# Altium project Driver.PrjPcb
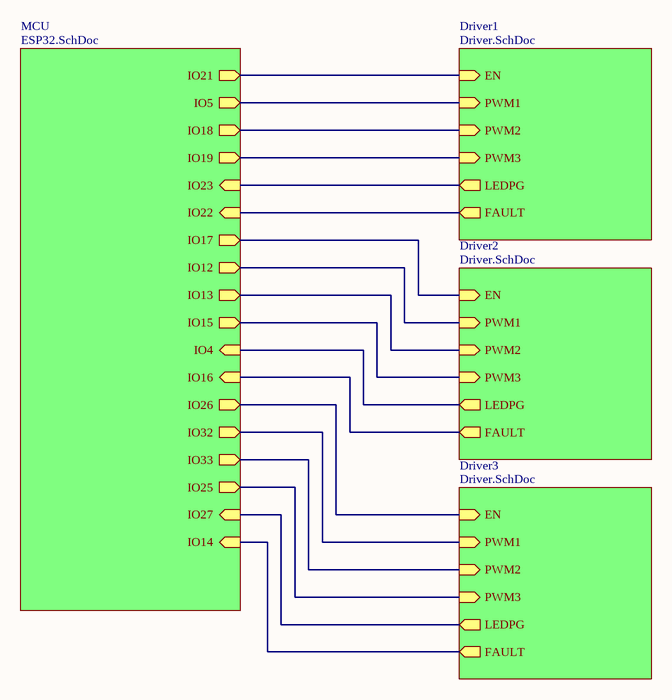
[diagram p0: Top_Design.SchDoc]
3 sheets, 38 parts. Net scope: hierarchical (ports join the sheet entries above them; power ports are global).
Board file: PCB1.PcbDoc
Sheets:
  Top_Design.SchDoc
    Driver1 = Driver.SchDoc
    MCU = ESP32.SchDoc
    Driver2 = Driver.SchDoc
    Driver3 = Driver.SchDoc

## Sheet Top_Design.SchDoc
size A4; SheetNumber: 1; SheetTotal: 3

### Sub-sheets
Driver1 = Driver.SchDoc: EN (in), PWM1 (in), PWM2 (in), PWM3 (in), LEDPG (out), FAULT (out)
Driver2 = Driver.SchDoc: EN (in), PWM1 (in), PWM2 (in), PWM3 (in), LEDPG (out), FAULT (out)
Driver3 = Driver.SchDoc: EN (in), PWM1 (in), PWM2 (in), PWM3 (in), LEDPG (out), FAULT (out)
MCU = ESP32.SchDoc: IO21 (out), IO5 (out), IO18 (out), IO19 (out), IO23 (in), IO22 (in), IO17 (out), IO12 (out), IO13 (out), IO15 (out), IO4 (in), IO16 (in), IO26 (out), IO32 (out), IO33 (out), IO25 (out), IO27 (in), IO14 (in)

### Nets
NetIC1_1_1: sheet Driver1/EN, sheet MCU/IO21
NetIC1_1_3: sheet Driver1/PWM3, sheet MCU/IO19
NetIC1_1_4: sheet Driver1/PWM2, sheet MCU/IO18
NetIC1_1_5: sheet Driver1/PWM1, sheet MCU/IO5
NetIC1_1_11: sheet Driver1/LEDPG, sheet MCU/IO23
NetIC1_1_12: sheet Driver1/FAULT, sheet MCU/IO22
NetIC1_2_1: sheet MCU/IO17, sheet Driver2/EN
NetIC1_2_3: sheet MCU/IO15, sheet Driver2/PWM3
NetIC1_2_4: sheet MCU/IO13, sheet Driver2/PWM2
NetIC1_2_5: sheet MCU/IO12, sheet Driver2/PWM1
NetIC1_2_11: sheet MCU/IO4, sheet Driver2/LEDPG
NetIC1_2_12: sheet MCU/IO16, sheet Driver2/FAULT
NetIC1_3_1: sheet MCU/IO26, sheet Driver3/EN
NetIC1_3_3: sheet MCU/IO25, sheet Driver3/PWM3
NetIC1_3_4: sheet MCU/IO33, sheet Driver3/PWM2
NetIC1_3_5: sheet MCU/IO32, sheet Driver3/PWM1
NetIC1_3_11: sheet MCU/IO27, sheet Driver3/LEDPG
NetIC1_3_12: sheet MCU/IO14, sheet Driver3/FAULT

## Sheet Driver.SchDoc
size A4; SheetNumber: 3; SheetTotal: 3
Used 3 times, as channels Driver1, Driver2, Driver3. Parts and nets are listed once, with the designators drawn on the sheet.
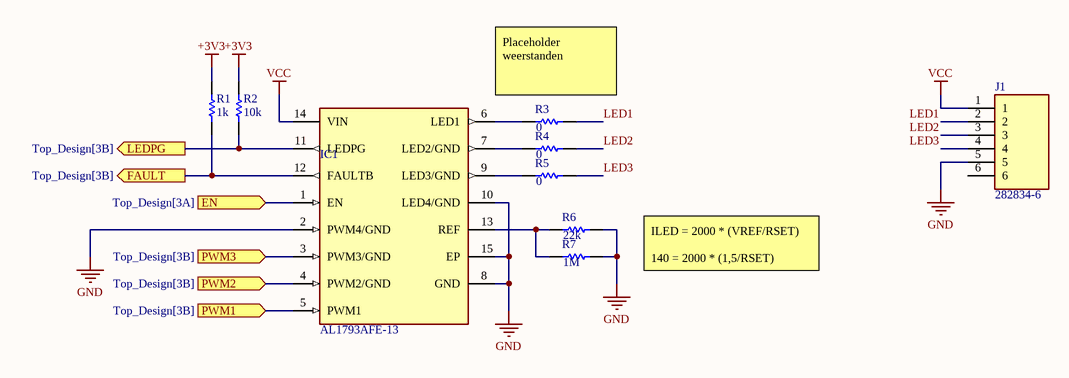
[diagram p1: Driver.SchDoc]

### Parts
IC1  AL1793AFE-13  [AL1793AFE13]
J1  282834-6  [2828346]
R1  value 1k  [RESC2013X70X40ML20T20]  (hidden comment: Resistor 1k +/-1% 0805 125 mW)
R2  value 10k  [RESC2013X70X40ML20T20]  (hidden comment: Resistor 1k +/-1% 0805 125 mW)
R3  value 0  [RESC2013X70X40ML20T20]  (hidden comment: Resistor 1k +/-1% 0805 125 mW)
R4  value 0  [RESC2013X70X40ML20T20]  (hidden comment: Resistor 1k +/-1% 0805 125 mW)
R5  value 0  [RESC2013X70X40ML20T20]  (hidden comment: Resistor 1k +/-1% 0805 125 mW)
R6  value 22k  [RESC2013X70X40ML20T20]  (hidden comment: Resistor 1k +/-1% 0805 125 mW)
R7  value 1M  [RESC2013X70X40ML20T20]  (hidden comment: Resistor 1k +/-1% 0805 125 mW)

### Ports
EN (in, see Top_Design[3A]), FAULT (out, see Top_Design[3B]), LEDPG (out, see Top_Design[3B]), PWM1 (in, see Top_Design[3B]), PWM2 (in, see Top_Design[3B]), PWM3 (in, see Top_Design[3B])

### Nets
+3V3: R1.2 R2.2
GND: IC1.2(PWM4/GND) IC1.8(GND) IC1.10(LED4/GND) IC1.15(EP) J1.5 R6.2 R7.2
VCC: IC1.14(VIN) J1.1
EN: IC1.1(EN) ; port EN
FAULT: IC1.12(FAULTB) R1.1 ; port FAULT
LED1: J1.2 R3.2
LED2: J1.3 R4.2
LED3: J1.4 R5.2
LEDPG: IC1.11(LEDPG) R2.1 ; port LEDPG
PWM1: IC1.5(PWM1) ; port PWM1
PWM2: IC1.4(PWM2/GND) ; port PWM2
PWM3: IC1.3(PWM3/GND) ; port PWM3
NetIC1_6: IC1.6(LED1) R3.1
NetIC1_7: IC1.7(LED2/GND) R4.1
NetIC1_9: IC1.9(LED3/GND) R5.1
NetIC1_13: IC1.13(REF) R6.1 R7.1

Not connected (* = marked no-connect by the designer): J1 6

### Channels
Driver1: designators end in _1; ports EN=NetIC1_1_1 FAULT=NetIC1_1_12 LEDPG=NetIC1_1_11 PWM1=NetIC1_1_5 PWM2=NetIC1_1_4 PWM3=NetIC1_1_3
Driver2: designators end in _2; ports EN=NetIC1_2_1 FAULT=NetIC1_2_12 LEDPG=NetIC1_2_11 PWM1=NetIC1_2_5 PWM2=NetIC1_2_4 PWM3=NetIC1_2_3
Driver3: designators end in _3; ports EN=NetIC1_3_1 FAULT=NetIC1_3_12 LEDPG=NetIC1_3_11 PWM1=NetIC1_3_5 PWM2=NetIC1_3_4 PWM3=NetIC1_3_3

### Notes on the sheet
- Placeholder weerstanden
- ILED = 2000 * (VREF/RSET)
  140 = 2000 * (1,5/RSET)

### Library data of the parts
IC1 = AL1793AFE-13: Integrated Circuit; Manufacturer_Name: Diodes Incorporated; Datasheet Link: https://www.diodes.com//assets/Datasheets/AL1791_1792_1793_1794.pdf; Height: 0.65mm; Manufacturer_Part_Number: AL1793AFE-13; Mouser Part Number: 621-AL1793AFE-13; Mouser Price/Stock: https://www.mouser.co.uk/ProductDetail/Diodes-Incorporated/AL1793AFE-13?qs=bKenfurwlskeSg5Tj2A9LQ%3D%3D; Arrow Part Number: AL1793AFE-13; Arrow Price/Stock: https://www.arrow.com/en/products/al1793afe-13/diodes-incorporated?region=nac
J1 = 282834-6: Connector; Manufacturer_Name: TE Connectivity; Datasheet Link: https://www.te.com/commerce/DocumentDelivery/DDEController?Action=srchrtrv&DocNm=1-1773458-1_EURO_STYLE_QRG&DocType=Data%20Sheet&DocLang=English&PartCntxt=282834-6&DocFormat=pdf; Height: 10.3mm; Manufacturer_Part_Number: 282834-6; Mouser Part Number: 571-282834-6; Mouser Price/Stock: https://www.mouser.co.uk/ProductDetail/TE-Connectivity/282834-6?qs=A%252Bip%252BNCYi6M0eRGalLqPCg%3D%3D; Arrow Part Number: 282834-6; Arrow Price/Stock: https://www.arrow.com/en/products/282834-6/te-connectivity?utm_currency=USD&region=nac
R1 = CMP-009-00010-5: Chip Resistor, 1 KOhm, +/- 1%, 0.125 W, -55 to 155 degC, 0805 (2013 Metric); Power: 125mW; Voltage Rating: 150V; Tolerance: 1%; RoHS Compliant: True; Mounting Technology: SM; Pins: 2; Case/Package: 0805; Max Operating Temperature: 155°C; Min Operating Temperature: -55°C
R2 = CMP-009-00010-5: Chip Resistor, 10 KOhm, +/- 1%, 0.125 W, -55 to 155 degC, 0805 (2013 Metric); Power: 125mW; Voltage Rating: 150V; Tolerance: 1%; RoHS Compliant: True; Mounting Technology: SM; Pins: 2; Case/Package: 0805; Max Operating Temperature: 155°C; Min Operating Temperature: -55°C
R3-R5 = CMP-009-00010-5: Chip Resistor, 0 Ohm, +/- 1%, 0.125 W, -55 to 155 degC, 0805 (2013 Metric); Power: 125mW; Voltage Rating: 150V; Tolerance: 1%; RoHS Compliant: True; Mounting Technology: SM; Pins: 2; Case/Package: 0805; Max Operating Temperature: 155°C; Min Operating Temperature: -55°C
R6 = CMP-009-00010-5: Chip Resistor, 22 KOhm, +/- 1%, 0.125 W, -55 to 155 degC, 0805 (2013 Metric); Power: 125mW; Voltage Rating: 150V; Tolerance: 1%; RoHS Compliant: True; Mounting Technology: SM; Pins: 2; Case/Package: 0805; Max Operating Temperature: 155°C; Min Operating Temperature: -55°C
R7 = CMP-009-00010-5: Chip Resistor, 1 MOhm, +/- 1%, 0.125 W, -55 to 155 degC, 0805 (2013 Metric); Power: 125mW; Voltage Rating: 150V; Tolerance: 1%; RoHS Compliant: True; Mounting Technology: SM; Pins: 2; Case/Package: 0805; Max Operating Temperature: 155°C; Min Operating Temperature: -55°C

## Sheet ESP32.SchDoc
size A4; SheetNumber: 2; SheetTotal: 3
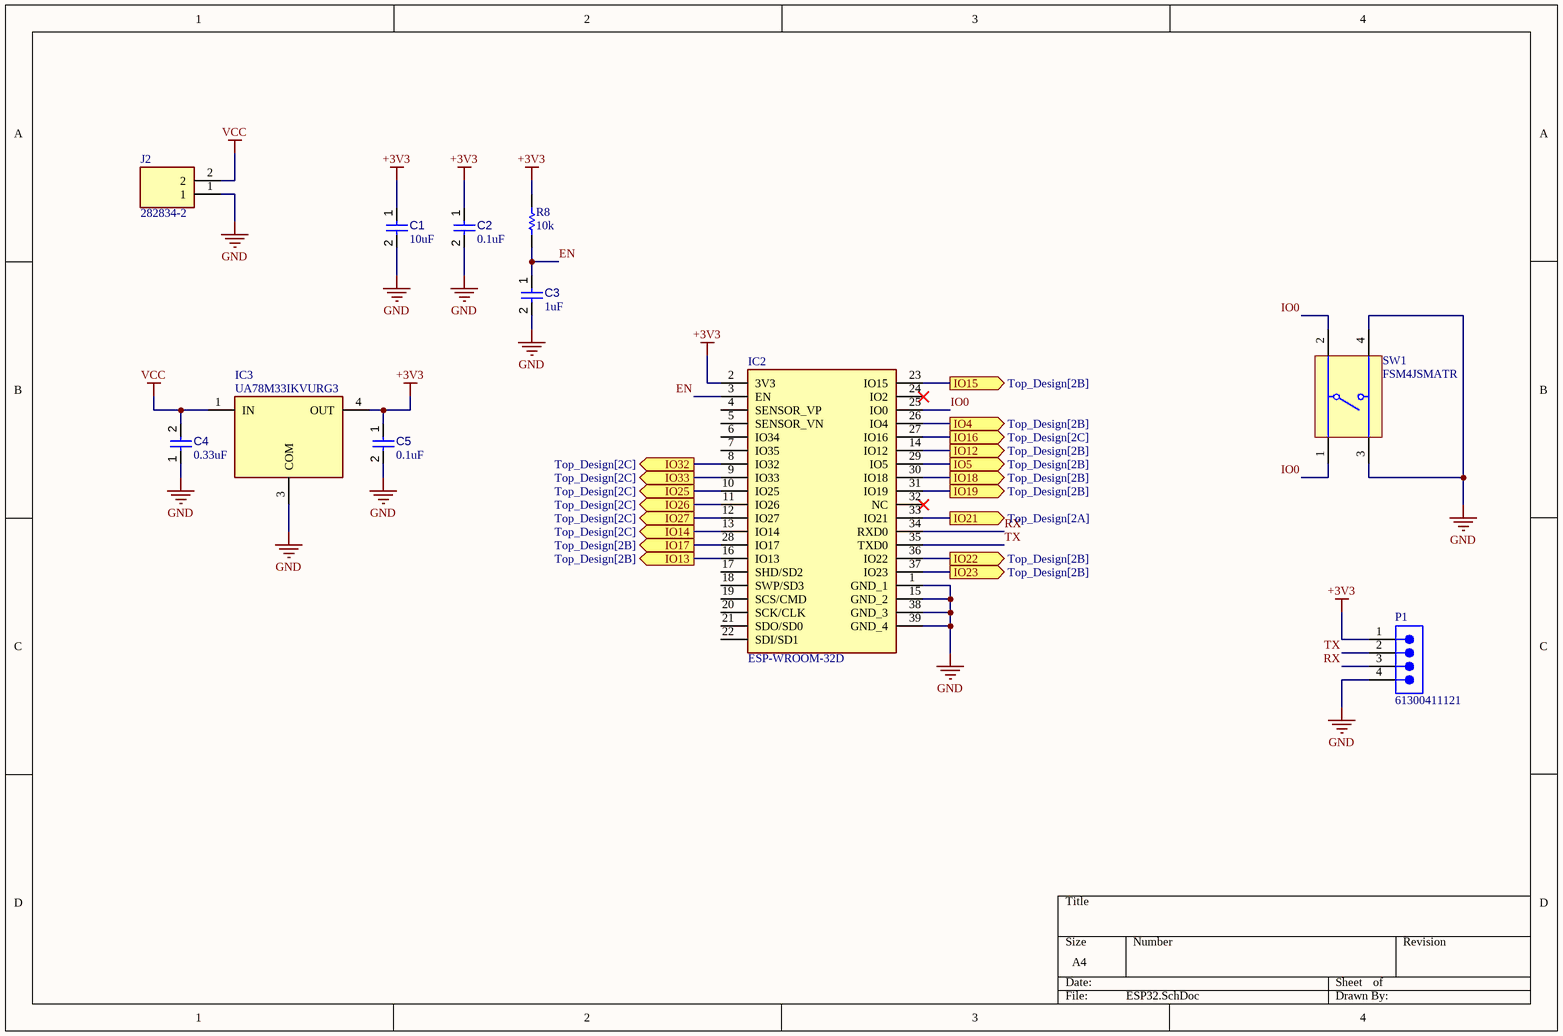
[diagram p2: ESP32.SchDoc]

### Parts
C1  value 10uF  [CAPC2013X95X50LL10T25]  (hidden comment: Capacitor 10 µF +/-10% 50 V 0805)
C2  value 0.1uF  [CAPC2013X95X50LL10T25]  (hidden comment: Capacitor 0.1 µF +/-10% 50 V 0805)
C3  value 1uF  [CAPC2013X95X50LL10T25]  (hidden comment: Capacitor 100 nF +/-10% 50 V 0805)
C4  value 0.33uF  [CAPC2013X95X50LL10T25]  (hidden comment: Capacitor 100 nF +/-10% 50 V 0805)
C5  value 0.1uF  [CAPC2013X95X50LL10T25]  (hidden comment: Capacitor 100 nF +/-10% 50 V 0805)
IC2  ESP-WROOM-32D  [ESPWROOM32D]
IC3  UA78M33IKVURG3  [UA78M33IKVURG3]
J2  282834-2  [282834-2_1]
P1  61300411121  [61300411121]
R8  value 10k  [RESC2013X70X40ML20T20]  (hidden comment: Resistor 1k +/-1% 0805 125 mW)
SW1  FSM4JSMATR  [TECO-FSM4JSMATR_V]

### Ports
IO4 (out, see Top_Design[2B]), IO5 (out, see Top_Design[2B]), IO12 (out, see Top_Design[2B]), IO13 (out, see Top_Design[2B]), IO14 (out, see Top_Design[2C]), IO15 (out, see Top_Design[2B]), IO16 (out, see Top_Design[2C]), IO17 (out, see Top_Design[2B]), IO18 (out, see Top_Design[2B]), IO19 (out, see Top_Design[2B]), IO21 (out, see Top_Design[2A]), IO22 (out, see Top_Design[2B]), IO23 (out, see Top_Design[2B]), IO25 (out, see Top_Design[2C]), IO26 (out, see Top_Design[2C]), IO27 (out, see Top_Design[2C]), IO32 (out, see Top_Design[2C]), IO33 (out, see Top_Design[2C])

### Nets
+3V3: C1.1 C2.1 C5.1 IC2.2(3V3) IC3.4(OUT) P1.1 R8.2
GND: C1.2 C2.2 C3.2 C4.1 C5.2 IC2.1(GND_1) IC2.15(GND_2) IC2.38(GND_3) IC2.39(GND_4) IC3.3(COM) J2.1 P1.4 SW1.3 SW1.4
VCC: C4.2 IC3.1(IN) J2.2
EN: C3.1 IC2.3(EN) R8.1
IO0: IC2.25(IO0) SW1.1 SW1.2
RX: IC2.34(RXD0) P1.3
TX: IC2.35(TXD0) P1.2
NetIC1_1_1: IC2.33(IO21) ; port IO21
NetIC1_1_3: IC2.31(IO19) ; port IO19
NetIC1_1_4: IC2.30(IO18) ; port IO18
NetIC1_1_5: IC2.29(IO5) ; port IO5
NetIC1_1_11: IC2.37(IO23) ; port IO23
NetIC1_1_12: IC2.36(IO22) ; port IO22
NetIC1_2_1: IC2.28(IO17) ; port IO17
NetIC1_2_3: IC2.23(IO15) ; port IO15
NetIC1_2_4: IC2.16(IO13) ; port IO13
NetIC1_2_5: IC2.14(IO12) ; port IO12
NetIC1_2_11: IC2.26(IO4) ; port IO4
NetIC1_2_12: IC2.27(IO16) ; port IO16
NetIC1_3_1: IC2.11(IO26) ; port IO26
NetIC1_3_3: IC2.10(IO25) ; port IO25
NetIC1_3_4: IC2.9(IO33) ; port IO33
NetIC1_3_5: IC2.8(IO32) ; port IO32
NetIC1_3_11: IC2.12(IO27) ; port IO27
NetIC1_3_12: IC2.13(IO14) ; port IO14

Not connected (* = marked no-connect by the designer): IC2 4(SENSOR_VP) 5(SENSOR_VN) 6(IO34) 7(IO35) 17(SHD/SD2) 18(SWP/SD3) 19(SCS/CMD) 20(SCK/CLK) 21(SDO/SD0) 22(SDI/SD1) 24(IO2)* 32(NC)*

### Library data of the parts
C1 = CMP-001-00018-6: Chip Capacitor, 10 µF, +/- 10%, 50 V, 0805 (2012 Metric); Capacitor Type: Ceramic; Voltage Rating: 50V; Pins: 2; Max Operating Temperature: 125°C; Min Operating Temperature: -55°C; Mounting Technology: SM; Case/Package: 0805; RoHS Compliant: True; Tolerance: 10%
C2 C5 = CMP-001-00018-6: Chip Capacitor, 100 nF, +/- 10%, 50 V, 0805 (2012 Metric); Capacitor Type: Ceramic; Voltage Rating: 50V; Pins: 2; Max Operating Temperature: 125°C; Min Operating Temperature: -55°C; Mounting Technology: SM; Case/Package: 0805; RoHS Compliant: True; Tolerance: 10%
C3 = CMP-001-00018-6: Chip Capacitor, 1 µF, +/- 10%, 50 V, 0805 (2012 Metric); Capacitor Type: Ceramic; Voltage Rating: 50V; Pins: 2; Max Operating Temperature: 125°C; Min Operating Temperature: -55°C; Mounting Technology: SM; Case/Package: 0805; RoHS Compliant: True; Tolerance: 10%
C4 = CMP-001-00018-6: Chip Capacitor, 0.33 µF, +/- 10%, 50 V, 0805 (2012 Metric); Capacitor Type: Ceramic; Voltage Rating: 50V; Pins: 2; Max Operating Temperature: 125°C; Min Operating Temperature: -55°C; Mounting Technology: SM; Case/Package: 0805; RoHS Compliant: True; Tolerance: 10%
IC2 = ESP-WROOM-32D: Integrated Circuit; Manufacturer_Name: Espressif Systems; Datasheet Link: https://componentsearchengine.com/Datasheets/1/ESP-WROOM-32D.pdf; Height: 3.2mm; Manufacturer_Part_Number: ESP-WROOM-32D; Mouser Part Number: 356-ESP-WROOM-32D; Mouser Price/Stock: https://www.mouser.co.uk/ProductDetail/Espressif-Systems/ESP-WROOM-32D?qs=MLItCLRbWsyWVKgdQMcFuQ%3D%3D
IC3 = UA78M33IKVURG3: Integrated Circuit; pin to pad: 3>4 4>3; Manufacturer_Name: Texas Instruments; Datasheet Link: http://www.ti.com/lit/gpn/ua78m; Height: 2.52mm; Manufacturer_Part_Number: UA78M33IKVURG3; Mouser Part Number: 595-UA78M33IKVURG3; Mouser Price/Stock: https://www.mouser.co.uk/ProductDetail/Texas-Instruments/UA78M33IKVURG3?qs=dP8SwFlKThxMmGpfgS%2FADQ%3D%3D; Arrow Part Number: UA78M33IKVURG3; Arrow Price/Stock: https://www.arrow.com/en/products/ua78m33ikvurg3/texas-instruments?region=nac
J2 = 282834-2: Connector; Manufacturer_Name: TE Connectivity; Datasheet Link: https://www.te.com/commerce/DocumentDelivery/DDEController?Action=srchrtrv&DocNm=1-1773458-1_EURO_STYLE_QRG&DocType=Data%20Sheet&DocLang=English&PartCntxt=282834-2&DocFormat=pdf; Manufacturer_Part_Number: 282834-2; Mouser Part Number: 571-282834-2; Mouser Price/Stock: https://www.mouser.co.uk/ProductDetail/TE-Connectivity/282834-2?qs=A%252Bip%252BNCYi6N8cVKuk8xDog%3D%3D; Arrow Part Number: 282834-2; Arrow Price/Stock: https://www.arrow.com/en/products/282834-2/te-connectivity?utm_currency=USD&region=europe
P1 = CMP-1502-01064-3: NexarPartId: 32855522; Operating Supply Voltage: 250V; Pitch: 2.54mm; Contact Resistance: 20mΩ; Number of Positions: 4; Current Rating: 3A; Connector Type: Male Pin; Gender: Male; Contact Plating: Gold; Height: 8.89mm; Lead Pitch: 2.54mm; Lead Free: Lead Free; Contact Mating Length: 5.9944mm; Number of Rows: 1; Termination: Solder; Packaging: Bulk; REACH SVHC: Unknown; Min Operating Temperature: -40°C; RoHS: Compliant; Number of Contacts: 4; Voltage Rating: 250V; Color: Black; Max Operating Temperature: 105°C; Contact Material: Copper; Mount: Through Hole; Orientation: Vertical; Number of Pins: 4
R8 = CMP-009-00010-5: as R2 on sheet Driver; Tolerance: 1%; RoHS Compliant: True; Mounting Technology: SM; Pins: 2; Case/Package: 0805; Max Operating Temperature: 155°C; Min Operating Temperature: -55°C
SW1 = CMP-2000-07486-1: Micro Miniature Push Button Switch FSM JSM, 50 mA, -35 to 85 degC, 4-Pin SMD, RoHS, Tape and Reel; Manufacturer: TE Connectivity; Mechanical Life: 100000Cycles; Current Rating: 50mA; Actuator Material: Polyamide; Max Voltage Rating (DC): 12V; Capacitance: 0f; Illumination Type: Illuminated; Voltage Rating (DC): 24V; Case\/Package: SMD/SMT; Operating Force: 160gf; Contact Resistance: 100mOhm; Actuator Length: 0.055inch; Switch Travel: 0.25mm; Throw Configuration: SPST; Termination: GullWing; Contact Plating: Silver; Orientation: Straight; Mounting Technology: SurfaceMount; REACH SVHC: Unknown; Electrical Life: 100000Cycles; Package Reference: FSM4JSMATR; Max Operating Temperature: 85degC; Manufacturer URL: http://www.te.com/; Package Description: 4-Pin Surface Mount Device, Body 6 x 6 mm, Pitch 4.5 mm; Datasheet Version: Rev. V, 02/2015; Packaging: TapeandReel; Min Operating Temperature: -35degC; Mount: SurfaceMount; Contact Current Rating: 50mA; Contact Material: CopperAlloy; Package Quantity: 1200; Datasheet URL: http://www.te.com/commerce/DocumentDelivery/DDEController?Action=showdoc&DocId=Customer+Drawing%7F2-1437565-7%7FV%7Fpdf%7FEnglish%7FENG_CD_2-1437565-7_V.pdf%7F4-1437565-2; RoHSCompliant: true

## Nets that join several sheets
+3V3: Driver1 (R1_1.2 R2_1.2), ESP32 (7 pins), Driver2 (R1_2.2 R2_2.2), Driver3 (R1_3.2 R2_3.2)
GND: Driver1 (7 pins), ESP32 (14 pins), Driver2 (7 pins), Driver3 (7 pins)
VCC: Driver1 (IC1_1.14 J1_1.1), ESP32 (C4.2 IC3.1 J2.2), Driver2 (IC1_2.14 J1_2.1), Driver3 (IC1_3.14 J1_3.1)
NetIC1_1_1: Driver1 (IC1_1.1), ESP32 (IC2.33)
NetIC1_1_3: Driver1 (IC1_1.3), ESP32 (IC2.31)
NetIC1_1_4: Driver1 (IC1_1.4), ESP32 (IC2.30)
NetIC1_1_5: Driver1 (IC1_1.5), ESP32 (IC2.29)
NetIC1_1_11: Driver1 (IC1_1.11 R2_1.1), ESP32 (IC2.37)
NetIC1_1_12: Driver1 (IC1_1.12 R1_1.1), ESP32 (IC2.36)
NetIC1_2_1: ESP32 (IC2.28), Driver2 (IC1_2.1)
NetIC1_2_3: ESP32 (IC2.23), Driver2 (IC1_2.3)
NetIC1_2_4: ESP32 (IC2.16), Driver2 (IC1_2.4)
NetIC1_2_5: ESP32 (IC2.14), Driver2 (IC1_2.5)
NetIC1_2_11: ESP32 (IC2.26), Driver2 (IC1_2.11 R2_2.1)
NetIC1_2_12: ESP32 (IC2.27), Driver2 (IC1_2.12 R1_2.1)
NetIC1_3_1: ESP32 (IC2.11), Driver3 (IC1_3.1)
NetIC1_3_3: ESP32 (IC2.10), Driver3 (IC1_3.3)
NetIC1_3_4: ESP32 (IC2.9), Driver3 (IC1_3.4)
NetIC1_3_5: ESP32 (IC2.8), Driver3 (IC1_3.5)
NetIC1_3_11: ESP32 (IC2.12), Driver3 (IC1_3.11 R2_3.1)
NetIC1_3_12: ESP32 (IC2.13), Driver3 (IC1_3.12 R1_3.1)